# Altium schematic sheet 03-VGA.SchDoc
size A4; 学校: 辽宁工程技术大学; 考号: 2107010403; 证件号: 532124200305070711; 图号: 第1幅; 图号数: 总共7幅; SheetNumber: 3; SheetTotal: 6; 单位名称: 辽宁工程技术大学; 身份证号: 532124200305070711; 姓名: 邓祥涛; 图名: mydesign; 选手编号: 84011514
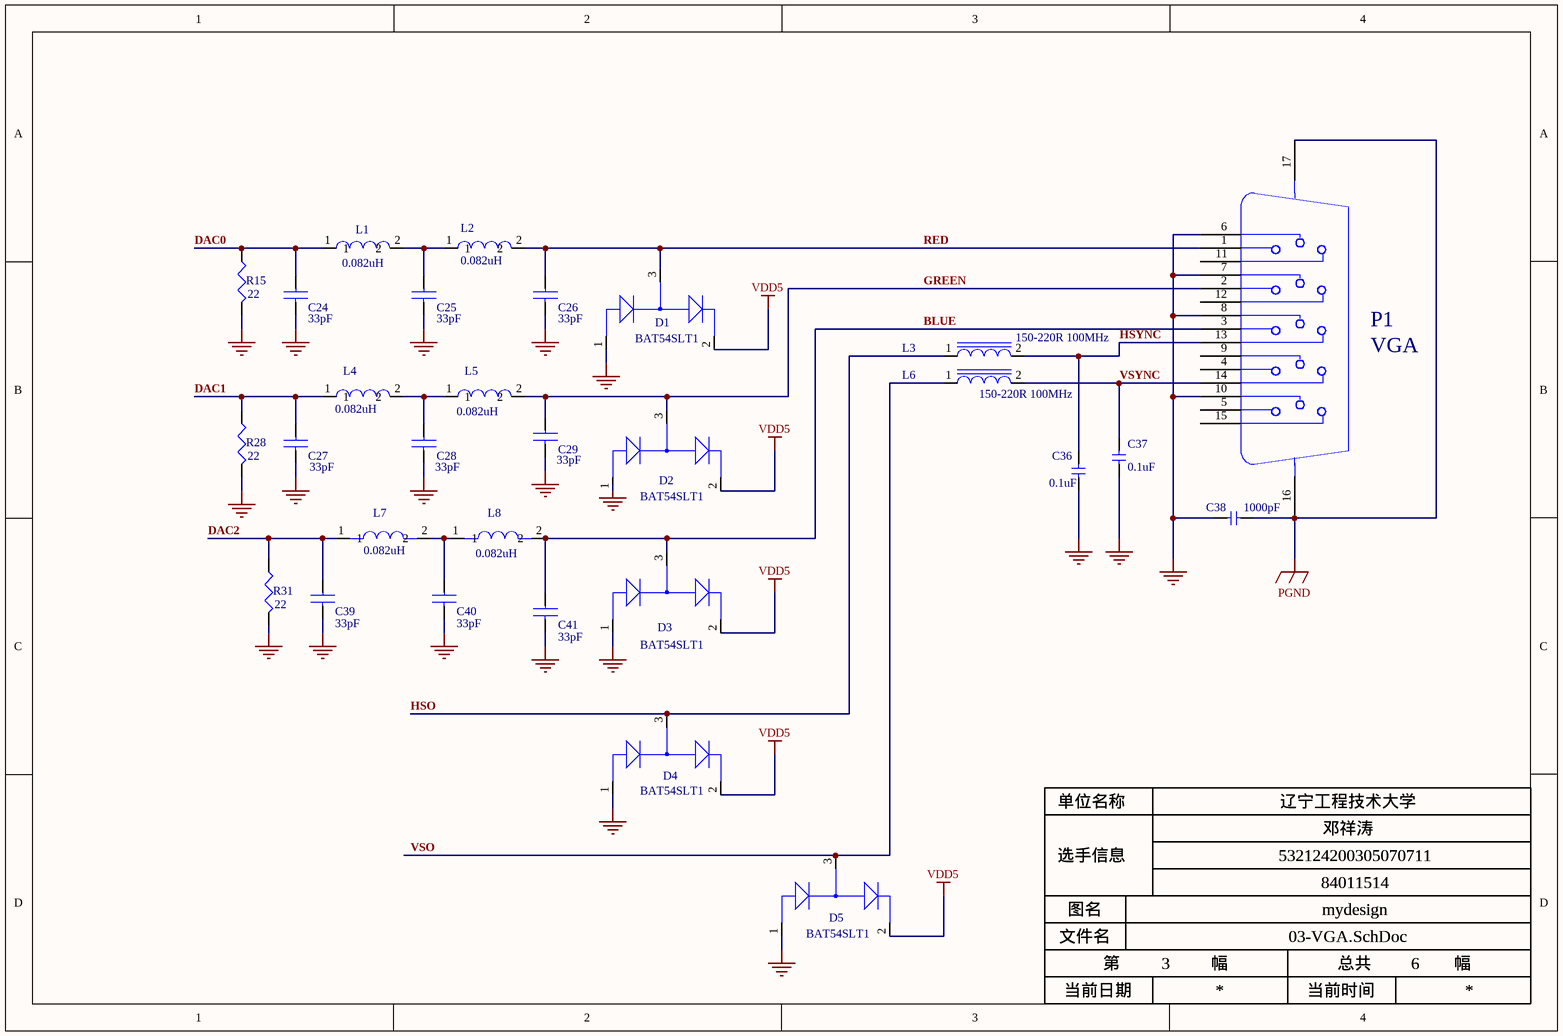
[diagram p0: 03-VGA.SchDoc]

## Parts
C24  value 33pF  [C0603]  (hidden comment: CAP)
C25  value 33pF  [C0603]  (hidden comment: CAP)
C26  value 33pF  [C0603]  (hidden comment: CAP)
C27  value 33pF  [C0603]  (hidden comment: CAP)
C28  value 33pF  [C0603]  (hidden comment: CAP)
C29  value 33pF  [C0603]  (hidden comment: CAP)
C36  value 0.1uF  [C0603]  (hidden comment: C_2)
C37  value 0.1uF  [C0603]  (hidden comment: C_2)
C38  value 1000pF  [C0603]  (hidden comment: C_2)
C39  value 33pF  [C0603]  (hidden comment: CAP)
C40  value 33pF  [C0603]  (hidden comment: CAP)
C41  value 33pF  [C0603]  (hidden comment: CAP)
D1  value BAT54SLT1  [SOT-23]  (hidden comment: DIODE_DUAL_SERIES_SOT23)
D2  value BAT54SLT1  [SOT-23]  (hidden comment: DIODE_DUAL_SERIES_SOT23)
D3  value BAT54SLT1  [SOT-23]  (hidden comment: DIODE_DUAL_SERIES_SOT23)
D4  value BAT54SLT1  [SOT-23]  (hidden comment: DIODE_DUAL_SERIES_SOT23)
D5  value BAT54SLT1  [SOT-23]  (hidden comment: DIODE_DUAL_SERIES_SOT23)
L1  value 0.082uH  [0805-l]  (hidden comment: L)
L2  value 0.082uH  [0805-l]  (hidden comment: L)
L3  value 150-220R 100MHz  [0805-l]  (hidden comment: L_0)
L4  value 0.082uH  [0805-l]  (hidden comment: L)
L5  value 0.082uH  [0805-l]  (hidden comment: L)
L6  value 150-220R 100MHz  [0805-l]  (hidden comment: L_0)
L7  value 0.082uH  [0805-l]  (hidden comment: FERRITE_BEAD)
L8  value 0.082uH  [0805-l]  (hidden comment: FERRITE_BEAD)
P1  value VGA  [DSUB-15]  (hidden comment: VGA_5)
R15  value 22  [R0603]  (hidden comment: RESISTOR_2)
R28  value 22  [R0603]  (hidden comment: RESISTOR_2)
R31  value 22  [R0603]  (hidden comment: RESISTOR_2)

## Nets
GND: C24.2 C25.2 C26.2 C27.2 C28.2 C29.2 C36.1 C37.1 C38.2 C39.2 C40.2 C41.2 D1.1(GND) D2.1(GND) D3.1(GND) D4.1(GND) D5.1(GND) P1.6 P1.7 P1.8 P1.10 R15.2 R28.2 R31.2
PGND: C38.1 P1.16 P1.17
VDD5: D1.2(VDD) D2.2(VDD) D3.2(VDD) D4.2(VDD) D5.2(VDD)
BLUE: C41.1 D3.3(SIGNAL) L8.2 P1.3
DAC0: C24.1 L1.1 R15.1
DAC1: C27.1 L4.1 R28.1
DAC2: C39.1 L7.1 R31.1
GREEN: C29.1 D2.3(SIGNAL) L5.2 P1.2
HSO: D4.3(SIGNAL) L3.1
HSYNC: C36.2 L3.2 P1.13
RED: C26.1 D1.3(SIGNAL) L2.2 P1.1
VSO: D5.3(SIGNAL) L6.1
VSYNC: C37.2 L6.2 P1.14
NetC25_1: C25.1 L1.2 L2.1
NetC28_1: C28.1 L4.2 L5.1
NetC40_1: C40.1 L7.2 L8.1

Not connected (* = marked no-connect by the designer): P1 4 5 9 11 12 15

## Notes on the sheet
- 单位名称
- 选手信息
- 图名
- 文件名
- 当前日期
- 第
- 幅
- 当前时间
- 总共

## Library data of the parts
C24-C29 C39-C41 = CAP: PART_SHAPE: 0805; PCB DECAL: 0603; SOURCE_PATH: C:\ORCADWIN\CAPTURE\LIBRARY\CHRONTEL.OLB
C36-C38 = C_2: PCB DECAL: 0603; SOURCE_PATH: C:\ORCAD\ORCAD_10.0\TOOLS\CAPTURE\LIBRARY\PSPICE\ANALOG.OLB; DIST: FLAT; PSPICETEMPLATE: C^@REFDES %1 %2 ?TOLERANCE|C^@REFDES| @VALUE ?IC/IC=@IC/ ?TOLERANCE|\n.model C^@REFDES CAP C=1 DEV=@TOLERANCE%|; VOLTAGE: CMAX; CURRENT: CIMAX; KNEE: CBMAX; SLOPE: CSMAX; MAX_TEMP: CTMAX
D1-D5 = DIODE_DUAL_SERIES_SOT23: SOURCE_PATH: C:\DESIGNS\NV-LIB\ORCAD_LIB_0.05.OLB; SEPERATOR: /; INSTANCE: 091-00; PCB DECAL: SOT-23
L1 L2 L4 L5 = L: PCB DECAL: 0805; SOURCE_PATH: C:\ORCAD\ORCAD_10.0\TOOLS\CAPTURE\LIBRARY\PSPICE\ANALOG.OLB; DIST: FLAT; PSPICETEMPLATE: L^@REFDES %1 %2 ?TOLERANCE|L^@REFDES| @VALUE ?IC/IC=@IC/ ?TOLERANCE|\n.model l^@REFDES IND L=1 DEV=@TOLERANCE%|; CURRENT: LMAX; DIELECTRIC: DSMAX
L3 L6 = L_0: PCB DECAL: 0805; SOURCE_PATH: D:\CT318\EVALUATION BOARD\EVA BOARD.DSN; DIST: FLAT; PSPICETEMPLATE: L^@REFDES %1 %2 ?TOLERANCE|L^@REFDES| @VALUE ?IC/IC=@IC/ ?TOLERANCE|\n.model l^@REFDES IND L=1 DEV=@TOLERANCE%|; CURRENT: LMAX; DIELECTRIC: DSMAX
L7 L8 = FERRITE_BEAD: PCB DECAL: 0805; SOURCE_PATH: C:\ORCADWIN\CAPTURE\LIBRARY\CHRONTEL.OLB
P1 = VGA_5: SOURCE_PATH: D:\CT318\EVALUATION BOARD\EVA BOARD.DSN; PCB DECAL: DSUB-15
R15 R28 R31 = RESISTOR_2: PCB DECAL: 0603; SOURCE_PATH: C:\ORCADWIN\CAPTURE\LIBRARY\PCBDEV.OLB